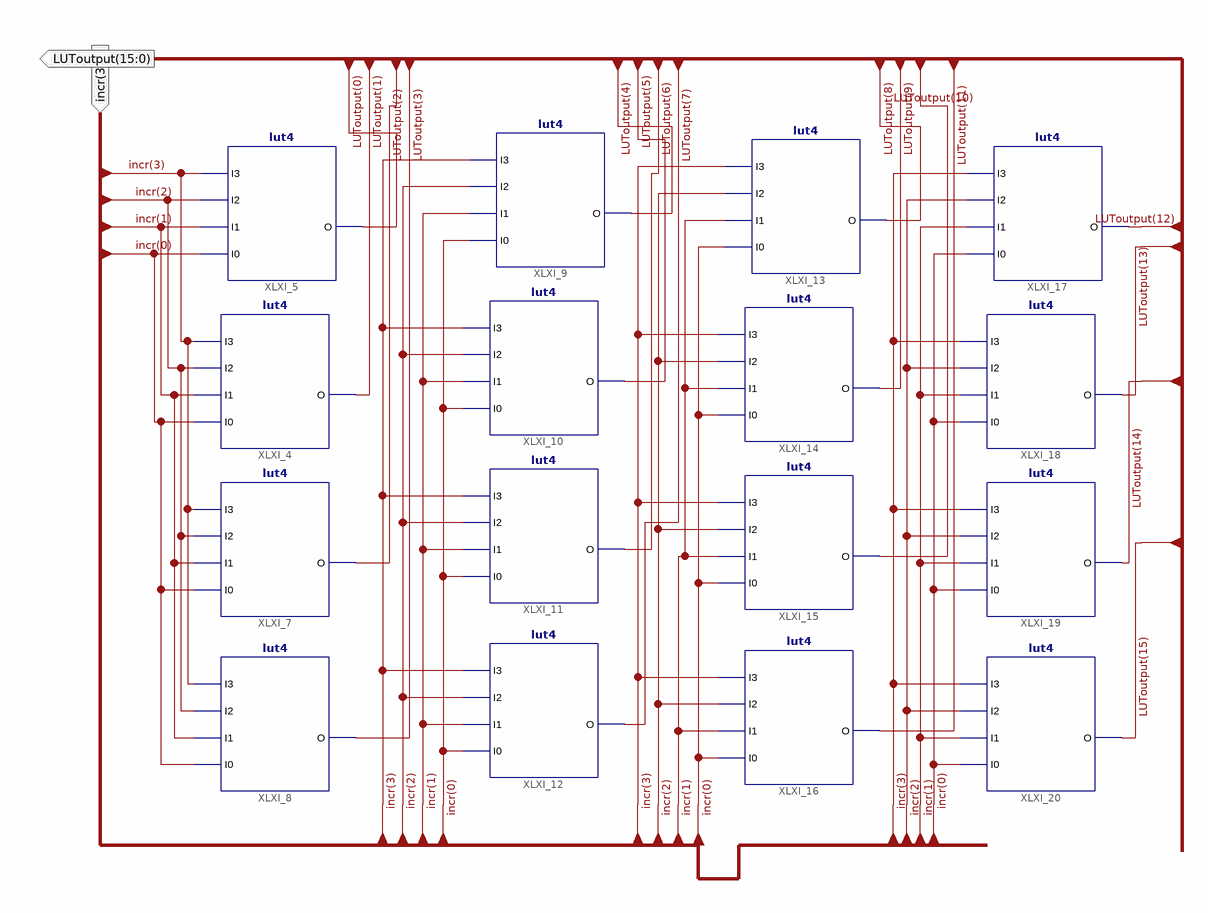
[diagram p0: schematic sheet 1]
// Xilinx ISE schematic LUTtable.sch (spartan3) as structural Verilog: 16 symbols, 2 ports
module LUTtable (
  input  [3:0] incr,
  output [15:0] LUToutput
);

  lut4 #(.INIT("040E")) XLXI_5 (.I0(incr[0]), .I1(incr[1]), .I2(incr[2]), .I3(incr[3]), .O(LUToutput[0]));
  lut4 #(.INIT("020E")) XLXI_4 (.I0(incr[0]), .I1(incr[1]), .I2(incr[2]), .I3(incr[3]), .O(LUToutput[1]));
  lut4 #(.INIT("0109")) XLXI_7 (.I0(incr[0]), .I1(incr[1]), .I2(incr[2]), .I3(incr[3]), .O(LUToutput[2]));
  lut4 #(.INIT("008E")) XLXI_8 (.I0(incr[0]), .I1(incr[1]), .I2(incr[2]), .I3(incr[3]), .O(LUToutput[3]));
  lut4 #(.INIT("004E")) XLXI_9 (.I0(incr[0]), .I1(incr[1]), .I2(incr[2]), .I3(incr[3]), .O(LUToutput[4]));
  lut4 #(.INIT("002D")) XLXI_10 (.I0(incr[0]), .I1(incr[1]), .I2(incr[2]), .I3(incr[3]), .O(LUToutput[5]));
  lut4 #(.INIT("001E")) XLXI_11 (.I0(incr[0]), .I1(incr[1]), .I2(incr[2]), .I3(incr[3]), .O(LUToutput[6]));
  lut4 #(.INIT("0006")) XLXI_12 (.I0(incr[0]), .I1(incr[1]), .I2(incr[2]), .I3(incr[3]), .O(LUToutput[7]));
  lut4 #(.INIT("0003")) XLXI_13 (.I0(incr[0]), .I1(incr[1]), .I2(incr[2]), .I3(incr[3]), .O(LUToutput[8]));
  lut4 #(.INIT("0001")) XLXI_14 (.I0(incr[0]), .I1(incr[1]), .I2(incr[2]), .I3(incr[3]), .O(LUToutput[9]));
  lut4 XLXI_15 (.I0(incr[0]), .I1(incr[1]), .I2(incr[2]), .I3(incr[3]), .O(LUToutput[10]));
  lut4 XLXI_16 (.I0(incr[0]), .I1(incr[1]), .I2(incr[2]), .I3(incr[3]), .O(LUToutput[11]));
  lut4 XLXI_17 (.I0(incr[0]), .I1(incr[1]), .I2(incr[2]), .I3(incr[3]), .O(LUToutput[12]));
  lut4 XLXI_18 (.I0(incr[0]), .I1(incr[1]), .I2(incr[2]), .I3(incr[3]), .O(LUToutput[13]));
  lut4 XLXI_19 (.I0(incr[0]), .I1(incr[1]), .I2(incr[2]), .I3(incr[3]), .O(LUToutput[14]));
  lut4 XLXI_20 (.I0(incr[0]), .I1(incr[1]), .I2(incr[2]), .I3(incr[3]), .O(LUToutput[15]));
endmodule
